# Altium schematic sheet Clock_Gen.SchDoc
size 431 x 279 mm; PartNumber: PNXXXXXXX; Organization: ORGANIZATION; Address1: 207; Address2: 13399 104 Ave; Address3: Surrey BC, V3T 0C9; Address4: Canada; Revision: V0.0.0; SheetNumber: 4; SheetTotal: 4; ENG_APP_DATE: --/--/--; DSN_APP_DATE: --/--/--; CHK_APP_DATE: --/--/--
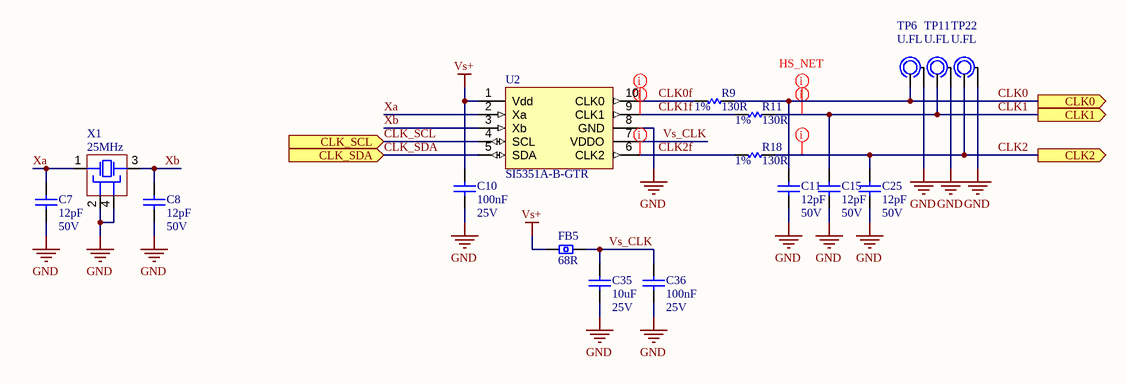
[diagram p0: Clock_Gen.SchDoc]

## Parts
C7  12pF  Voltage: 50V  [C0402]
C8  12pF  Voltage: 50V  [C0402]
C10  100nF  Voltage Rating: 25V  [C0402]
C11  12pF  Voltage: 50V  [C0402]
C15  12pF  Voltage: 50V  [C0402]
C25  12pF  Voltage: 50V  [C0402]
C35  10uF  Voltage Rating: 25V  [c0805]
C36  100nF  Voltage Rating: 25V  [C0402]
FB5  68R  [FB0402]
R9  130R  Tolerance: 1%  [R0402]
R11  130R  Tolerance: 1%  [R0402]
R18  130R  Tolerance: 1%  [R0402]
TP6  U.FL  [U.FL]
TP11  U.FL  [U.FL]
TP22  U.FL  [U.FL]
U2  SI5351A-B-GTR  [TSSOP50P490X110-10N]
X1  25MHz  [XTAL FA-238V 3.2x2.5mm]

## Ports
CLK0 (out), CLK1 (out), CLK2 (out), CLK_SCL (in), CLK_SDA (in)

## Nets
GND: C7.1 C8.1 C10.2 C11.1 C15.1 C25.1 C35.1 C36.2 TP6.0 TP11.0 TP22.0 U2.8(GND) X1.2 X1.4
Vs+: C10.1 FB5.2 U2.1(Vdd)
CLK0: C11.2 R9.1 TP6.1 ; port CLK0
CLK0f: R9.2 U2.10(CLK0)
CLK1: C15.2 R11.1 TP11.1 ; port CLK1
CLK1f: R11.2 U2.9(CLK1)
CLK2: C25.2 R18.1 TP22.1 ; port CLK2
CLK2f: R18.2 U2.6(CLK2)
CLK_SCL: U2.4(SCL) ; port CLK_SCL
CLK_SDA: U2.5(SDA) ; port CLK_SDA
Vs_CLK: C35.2 C36.1 FB5.1 U2.7(VDDO)
Xa: C7.2 U2.2(Xa) X1.1
Xb: C8.2 U2.3(Xb) X1.3

## Layout directives
net class HS_NET; rule Clearance Constraint [Generic clearance = 10mil, and 30 value(s) for objects]; rule Impedance Constraint [Min = 42.50    Max = 57.50    ]: CLK0, CLK0f, CLK1, CLK1f, CLK2, CLK2f

## Notes on the sheet
- REV:
- PROJECT:
- DATE:
- TITLE
- SHEET
- OF
- DESIGNED:
- REVIEWED:

## Library data of the parts
C7 C8 C11 C15 C25 = CAP CER 12pF 50V C0G 0402: Ceramic capacitor SMD-0402 12pF /50V C0G# J +-5%, Samsung, RoHS; Manufacturer Part Number: CL05C120JB5NNNC; Tolerance: 5%; Dielectric: C0G; Temperature Coefficient: 300ppm/°C; Supplier 1: Digi-Key; Manufacturer: Samsung; RoHS: Yes; Category: Ceramic Capacitors; Stock 1: 41998; Pricing 1: 10000=0.00386, 20000=0.00367 (USD); Mount: Surface Mount; Case/Package: 0402; Case Code (Metric): 1005; Case Code (Imperial): 0402; Material: Ceramic; Contact Plating: Tin; Min Operating Temperature: -55°C; Max Operating Temperature: 125°C; Capacitance: 12pF; Package Quantity: 1; Packaging: Tape and Reel; Voltage Rating: 50V; Series: CL; Construction: Flat; Voltage Rating (DC): 50V; Length: 1mm; Width: 0.02inch; Height: 0.5mm; Thickness: 0.022inch; Depth: 0.5mm; Radiation Hardening: No; RoHS Compliant: Yes; Lead Free: Lead Free; ComponentLink1URL: https://datasheet.ciiva.com/25806/cl05c120jb5nnnc-25806484.pdf?src-supplier=Digi-Key; ComponentLink1Description: https://datasheet.ciiva.com/25806/cl05c120jb5nnnc-25806484.pdf?src-supplier=Digi-Key; ComponentLink2URL: https://datasheet.ciiva.com/26838/getdatasheetpartid-658047-26838280.pdf?src-supplier=Verical; ComponentLink2Description: https://datasheet.ciiva.com/26838/getdatasheetpartid-658047-26838280.pdf?src-supplier=Verical; ComponentLink3URL: https://datasheet.ciiva.com/29198/458703-da-01-en-vs-kondensator-0402-29198421.pdf?src-supplier=Conrad; ComponentLink3Description: https://datasheet.ciiva.com/29198/458703-da-01-en-vs-kondensator-0402-29198421.pdf?src-supplier=Conrad; ComponentLink4URL: https://datasheet.ciiva.com/16449/cl05b104kq5nnnc-16449055.pdf?src-supplier=Future+Electronics; ComponentLink4Description: https://datasheet.ciiva.com/16449/cl05b104kq5nnnc-16449055.pdf?src-supplier=Future+Electronics; Supplier Part Number 1: 1276-1178-2-ND
C10 C36 = CAP CER 100nF 25V X5R 0402: Cap Ceramic 0.1uF 25V X5R 10% Pad SMD 0402 85¡ãC T/R / Multi Layer Ceramic Capacitor (MLCC); Manufacturer: Samsung; Manufacturer Part Number: CL05A104KA5NNNC; Supplier 1: Digi-Key; RoHS: Yes; Category: Ceramic Capacitors; Stock 1: 8053194; Pricing 1: 1=0.10000, 10=0.01100, 50=0.00600, 100=0.00490, 500=0.00346, 1000=0.00272, 2500=0.00248, 5000=0.00228 (USD); Mount: Surface Mount; Case/Package: 0402; Case Code (Metric): 1005; Case Code (Imperial): 0402; Min Operating Temperature: -55°C; Max Operating Temperature: 85°C; Capacitance: 100nF; Tolerance: 10%; Dielectric: X5R; Packaging: Tape and Reel; Package Quantity: 1; Voltage: 25V; Series: CL; Construction: Flat; Voltage Rating (DC): 25V; Length: 1mm; Width: 0.02inch; Height: 0.5mm; Thickness: 0.022inch; Depth: 0.5mm; Radiation Hardening: No; Lead Free: Lead Free; ComponentLink1URL: https://datasheet.ciiva.com/25802/cl05a104ka5nnnc-25802704.pdf?src-supplier=Digi-Key; ComponentLink1Description: https://datasheet.ciiva.com/25802/cl05a104ka5nnnc-25802704.pdf?src-supplier=Digi-Key; ComponentLink2URL: https://datasheet.ciiva.com/26838/getdatasheetpartid-357412-26838142.pdf?src-supplier=Verical; ComponentLink2Description: https://datasheet.ciiva.com/26838/getdatasheetpartid-357412-26838142.pdf?src-supplier=Verical; ComponentLink3URL: https://datasheet.ciiva.com/16437/cl05a104ka5nnnc-16437369.pdf?src-supplier=Future+Electronics; ComponentLink3Description: https://datasheet.ciiva.com/16437/cl05a104ka5nnnc-16437369.pdf?src-supplier=Future+Electronics; ComponentLink4URL: https://datasheet.ciiva.com/26309/mlcc-catalogdownload2013-eng-26309014.pdf?src-supplier=Distrelec; ComponentLink4Description: https://datasheet.ciiva.com/26309/mlcc-catalogdownload2013-eng-26309014.pdf?src-supplier=Distrelec; Supplier Part Number 1: 1276-1043-1-ND
C35 = CAP CER 10uF 25V X5R 0805: Cap Ceramic 10uF 25V X5R 10% SMD 0805 85°C Embossed T/R; Manufacturer: Samsung; Manufacturer Part Number: CL21A106KAYNNNE; Supplier 1: Digi-Key; RoHS: Yes; Category: Ceramic Capacitors; Stock 1: 2266338; Pricing 1: 2000=0.03549, 4000=0.03247 (USD); Mount: Surface Mount; Case/Package: 0805; Case Code (Metric): 2012; Case Code (Imperial): 0805; Min Operating Temperature: -55°C; Max Operating Temperature: 85°C; Package Quantity: 1; Packaging: Tape and Reel; Capacitance: 10uF; Tolerance: 10%; Dielectric: X5R; Series: CL; Construction: Flat; Length: 2mm; Width: 0.049inch; Height: 1.25mm; Depth: 1.25mm; Thickness: 0.057inch; Radiation Hardening: No; RoHS Compliant: Yes; ComponentLink1URL: https://datasheet.ciiva.com/25796/cl21a106kaynnne-25796720.pdf?src-supplier=Digi-Key; ComponentLink1Description: https://datasheet.ciiva.com/25796/cl21a106kaynnne-25796720.pdf?src-supplier=Digi-Key; ComponentLink2URL: https://datasheet.ciiva.com/26838/getdatasheetpartid-357558-26838583.pdf?src-supplier=Verical; ComponentLink2Description: https://datasheet.ciiva.com/26838/getdatasheetpartid-357558-26838583.pdf?src-supplier=Verical; Supplier Part Number 1: 1276-2891-2-ND
FB5 = FB 68R 400mA 310mR 0402: Ferrite Beads Multi-Layer 68Ohm 25% 100MHz 400mA 310mOhm DCR 0402 T/R; Manufacturer: Taiyo Yuden; Manufacturer Part Number: BK1005LL680-T; DC Resistance (DCR): 310mR; Number of Lines: 1; Shielding: Unshielded; Supplier 1: Digi-Key; RoHS: Yes; Category: Ferrite Beads and Chips; Stock 1: 9707; Pricing 1: 1=0.10000, 10=0.04100, 25=0.03640, 50=0.03300, 100=0.02970, 250=0.02176, 500=0.01584, 1000=0.01551, 5000=0.01056 (USD); Mount: Surface Mount; Case/Package: 0402; Number of Pins: 2; Case Code (Metric): 1005; Case Code (Imperial): 0402; Core Material: Ferrite; Min Operating Temperature: -55°C; Max Operating Temperature: 125°C; Packaging: Tape and Reel; Package Quantity: 1; Impedance: 68R; Tolerance: 25%; Max DC Current: 400mA; Termination: SMD/SMT; Test Frequency: 100MHz; Max Current Rating: 400mA; Series: BK; Frequency: 100MHz; Length: 0.039inch; Width: 0.02inch; Height: 0.022inch; Depth: 0.55mm; Halogen Free: Halogen Free; Lead Free: Lead Free; REACH SVHC: Unknown; ComponentLink1URL: https://datasheet.ciiva.com/1013/bk1005ll680-t-ss-1013936.pdf?src-supplier=Digi-Key; ComponentLink1Description: https://datasheet.ciiva.com/1013/bk1005ll680-t-ss-1013936.pdf?src-supplier=Digi-Key; ComponentLink2URL: https://datasheet.ciiva.com/1013/mlci07-e-1013935.pdf?src-supplier=Digi-Key; ComponentLink2Description: https://datasheet.ciiva.com/1013/mlci07-e-1013935.pdf?src-supplier=Digi-Key; ComponentLink3URL: https://datasheet.ciiva.com/1013/mlci07-e-1013937.pdf?src-supplier=Digi-Key; ComponentLink3Description: https://datasheet.ciiva.com/1013/mlci07-e-1013937.pdf?src-supplier=Digi-Key; Supplier Part Number 1: 587-1860-1-ND
R9 R11 R18 = RES 130R 1% 63mW 0402: Res General Purpose Thick Film 0402 130 Ohm 1% 1/16W ±100ppm/°C Molded SMD Paper T/R; Manufacturer 1: Yageo; Manufacturer Part Number 1: RC0402FR-07130RL; Category 1: Chip SMD Resistors; Power Rating: 62.5mW; Voltage Rating: 50V; Max Power Dissipation: 63mW; Supplier 1: Future Electronics; Supplier Part Number 1: 7796683; RoHS 1: Yes; Description 1: Res General Purpose Thick Film 0402 130 Ohm 1% 1/16W ±100ppm/°C Molded SMD Paper T/R; Stock 1: 330000; Pricing 1: 10000=0.00100, 50000=0.00090, 100000=0.00090, 300000=0.00080, 1000000=0.00080, 1250000=0.00080, 3000000=0.00070 (USD); Case/Package: 0402; Case Code (Metric): 1005; Case Code (Imperial): 0402; Min Operating Temperature: -55°C; Max Operating Temperature: 155°C; Value: 130R; Packaging: Tape and Reel; Package Quantity: 1; Resistor Type: Thick Film; Number of Terminations: 2; Termination: SMD/SMT; Temperature Coefficient: 100ppm/°C; Features: Moisture Resistant; Series: RC; Construction: Rectangular; Length: 1mm; Width: 0.02inch; Height: 0.016inch; Depth: 0.5mm; Military Standard: Not; Lead Free: Lead Free; RoHS Compliant: Yes; ComponentLink1URL: https://datasheet.ciiva.com/2519/pyu-r-int-thick-7-2519049.pdf?src-supplier=Digi-Key; ComponentLink1Description: https://datasheet.ciiva.com/2519/pyu-r-int-thick-7-2519049.pdf?src-supplier=Digi-Key; ComponentLink2URL: https://datasheet.ciiva.com/16744/pyu-rc0402-51-rohs-l-6-r-16744959.pdf?src-supplier=Future+Electronics; ComponentLink2Description: https://datasheet.ciiva.com/16744/pyu-rc0402-51-rohs-l-6-r-16744959.pdf?src-supplier=Future+Electronics; ComponentLink3URL: https://datasheet.ciiva.com/15189/getdatasheetpartid-327831-15189351.pdf?src-supplier=Verical; ComponentLink3Description: https://datasheet.ciiva.com/15189/getdatasheetpartid-327831-15189351.pdf?src-supplier=Verical; ComponentLink4URL: https://datasheet.ciiva.com/2519/pyu-r-int-thick-7-2519050.pdf?src-supplier=Digi-Key; ComponentLink4Description: https://datasheet.ciiva.com/2519/pyu-r-int-thick-7-2519050.pdf?src-supplier=Digi-Key; ComponentLink5URL: https://datasheet.ciiva.com/2519/pyu-r-int-thick-7-2519048.pdf?src-supplier=Digi-Key; ComponentLink5Description: https://datasheet.ciiva.com/2519/pyu-r-int-thick-7-2519048.pdf?src-supplier=Digi-Key; ComponentLink6URL: https://datasheet.ciiva.com/12666/pyu-rc0402-51-rohs-l-6-r-12666955.pdf?src-supplier=Mouser; ComponentLink6Description: https://datasheet.ciiva.com/12666/pyu-rc0402-51-rohs-l-6-r-12666955.pdf?src-supplier=Mouser
TP6 TP11 TP22 = TP U.FL: CONN U.FL RCPT STR 50 OHM SMD; Manufacturer: Hirose; Manufacturer Part Number: U.FL-R-SMT-1(80); Body Material: Bronze; Body Plating: Silver; Center Contact Plating: Gold; Dielectric Material: Polymer; Connector Type: Receptacle,Male Pin; Impedance: 50R; Max Frequency: 6GHz; Number of Ports: 1; Mating Cycles: 30; Supplier 1: Future Electronics; RoHS: Yes; Category: RF / Coaxial Connectors; Stock 1: 40000; Pricing 1: 10000=0.81500, 20000=0.80000, 30000=0.78500 (USD); Mount: Surface Mount; Case/Package: SMD/SMT; Contact Material: Brass; Housing Color: Beige; Min Operating Temperature: -40°C; Max Operating Temperature: 90°C; Package Quantity: 10000; Packaging: Tape and Reel; Fastening Type: SNAP-ON; Series: U.FL; Termination: Solder; Lead Free: Lead Free; RoHS Compliant: Yes; ComponentLink1URL: http://www.mouser.com/ds/2/185/U.FL_catalog-939761.pdf?src-supplier=Mouser; ComponentLink1Description: http://www.mouser.com/ds/2/185/U.FL_catalog-939761.pdf?src-supplier=Mouser; ComponentLink2URL: https://www.hirose.com/product/en/download_file/key_name/U.FL-R-SMT-1%2880%29/category/Specification%20Sheet/doc_file_id/37638/?file_category_id=9&item_id=03310472280&is_series=&src-supplier=Digi-Key; ComponentLink2Description: https://www.hirose.com/product/en/download_file/key_name/U.FL-R-SMT-1%2880%29/category/Specification%20Sheet/doc_file_id/37638/?file_category_id=9&item_id=03310472280&is_series=&src-supplier=Digi-Key
U2 = IC CLK GEN 200MHz 3 chan SI5351A-B-GTR: SILICON LABS - SI5351A-B-GTR - Générateur d'horloge Programmable, 200MHz, Alim. 2,25V à 3.6V, 3 sorties, MSOP-10; Category 1: Clock Generators, PLLs, Frequency Synthesizers; Number of Outputs: 3; Max Duty Cycle: 55%; Operating Supply Current: 22mA; Number of Circuits: 2; Input: Crystal; PLL: Yes; Operating Supply Voltage: 3.3V; Supplier 1: Newark; Supplier Part Number 1: 03AH2981; Manufacturer 1: Silicon Labs; Manufacturer Part Number 1: SI5351A-B-GTR; RoHS 1: Yes; Description 1: SILICON LABS - SI5351A-B-GTR - Générateur d'horloge Programmable, 200MHz, Alim. 2,25V à 3.6V, 3 sorties, MSOP-10; Mounting Technology: Surface Mount; Case/Package: MSOP; Pins: 10; Min Operating Temperature: -40°C; Max Operating Temperature: 85°C; Packaging: Tape and Reel; Package Quantity: 2500; Clock Frequency: 200MHz; Series: MultiSynth™; RoHS Compliant: Yes; ComponentLink1URL: http://www.farnell.com/datasheets/2802507.pdf?src-supplier=Farnell; ComponentLink1Description: http://www.farnell.com/datasheets/2802507.pdf?src-supplier=Farnell; ComponentLink2URL: http://www.mouser.com/ds/2/368/Si5351-B-346869.pdf?src-supplier=Mouser; ComponentLink2Description: http://www.mouser.com/ds/2/368/Si5351-B-346869.pdf?src-supplier=Mouser; ComponentLink3URL: https://www.silabs.com/Support%20Documents/TechnicalDocs/Si5351-B.pdf?src-supplier=Avnet; ComponentLink3Description: https://www.silabs.com/Support%20Documents/TechnicalDocs/Si5351-B.pdf?src-supplier=Avnet; ComponentLink4URL: https://www.silabs.com/documents/public/data-sheets/Si5351-B.pdf?src-supplier=Digi-Key; ComponentLink4Description: https://www.silabs.com/documents/public/data-sheets/Si5351-B.pdf?src-supplier=Digi-Key; ComponentLink5URL: https://www.silabs.com/Support%20Documents/TechnicalDocs/Si5350-51-short.pdf?src-supplier=Digi-Key; ComponentLink5Description: https://www.silabs.com/Support%20Documents/TechnicalDocs/Si5350-51-short.pdf?src-supplier=Digi-Key; ComponentLink6URL: http://www.farnell.com/datasheets/2802507.pdf?src-supplier=Newark; ComponentLink6Description: http://www.farnell.com/datasheets/2802507.pdf?src-supplier=Newark
X1 = XTAL 25MHz 50ppm 12pF 3.2x2.5mm: Crystal 25MHz ±50ppm (Tol) ±30ppm (Stability) 12pF FUND 50Ohm 4-Pin CSMD T/R; Manufacturer: Epson; Manufacturer Part Number: FA-23825.0000MB-W0; ESR (Equivalent Series Resistance): 50R; Drive Level: 200uW; Supplier 1: Mouser; RoHS: Yes; Category: Crystals; Mount: Surface Mount; Case/Package: SMD/SMT; Weight: 0.000564oz; Min Operating Temperature: -20°C; Max Operating Temperature: 70°C; Frequency: 25MHz; Tolerance: 50ppm; Load Capacitance: 12pF; Packaging: Tape and Reel; Package Quantity: 1000; Termination: SMD/SMT; Frequency Stability: 30ppm; Frequency Tolerance: 50ppm; Series: FA-238; Length: 0.126inch; Width: 0.098inch; Height: 0.028inch; RoHS Compliant: Yes; ComponentLink1URL: https://datasheet.ciiva.com/4948/1729491-472357-4948905.pdf?src-supplier=Mouser; ComponentLink1Description: https://datasheet.ciiva.com/4948/1729491-472357-4948905.pdf?src-supplier=Mouser; Supplier Part Number 1: 732-FA238-25B-W0